# EAGLE design am-crystal-rx (EAGLE 7.6.0)
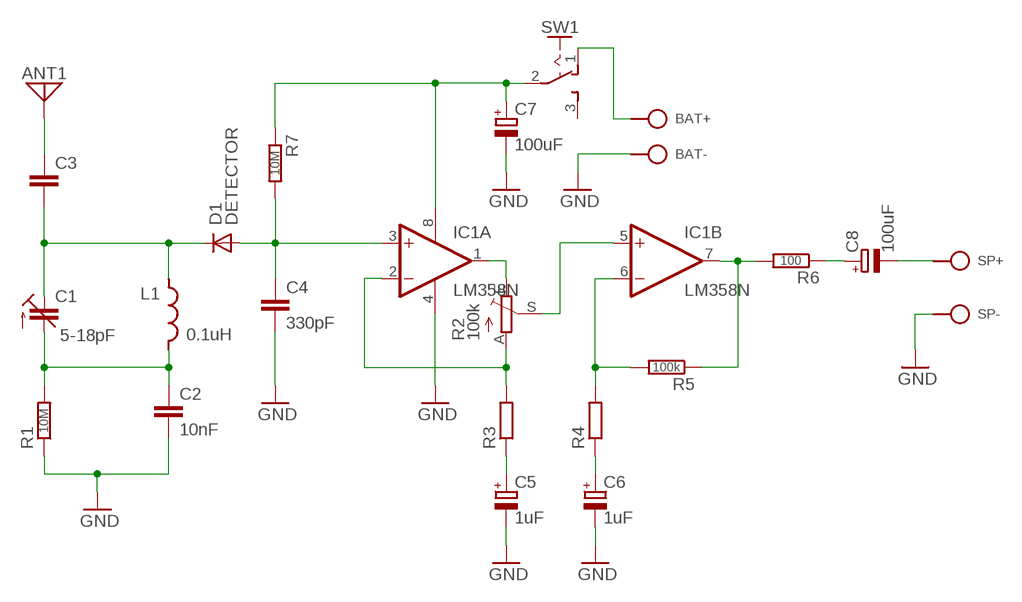
[diagram p0: schematic, sheet 1]

## Parts
ANT1  ANT  [SPAD]
BAT+  BAT+  SPAD  [SPAD]
BAT-  BAT-  SPAD  [SPAD]
C1  5-18pF  C-TR-PH201272222-808-2PIN  [TRIM-2222-808]
C2  10nF  C050-025X075  [C050-025X075]
C3  C025-015X024  [C025-015X024]
C4  330pF  C050-024X044  [C050-024X044]
C5  1uF  CPOLE2,5-3  [E2,5-3]
C6  1uF  CPOLE2,5-3  [E2,5-3]
C7  100uF  CPOLE2.5-5  [E2,5-5]
C8  100uF  CPOLE2.5-5  [E2,5-5]
D1  DETECTOR  1N414834-10  [DO34-10]
IC1  LM358N  [DIL08]
L1  0.1uH  L-SHORT04/10  [L-04/10]
R1  10M  R0202/7-V  [0202/7-V]
R2  100k  TRIM_EU-B64Y  [B64Y]
R3  R0202/7  [0202/7]
R4  R0202/7  [0202/7]
R5  100k  R0202/7  [0202/7]
R6  100  R0202/7  [0202/7]
R7  10M  R0202/7  [0202/7]
SP+  SPKR+  SPAD  [SPAD]
SP-  SPKR-  SPAD  [SPAD]
SW1  SL-SW-1P-2T-H  [SLSW-1P2T-H]

## Nets
GND: BAT-.1 C2.2 C4.2 C5.- C6.- C7.- IC1.4(P:V-) R1.1 SP-.1
N$1: C4.1 D1.A IC1.3(A:+IN) R7.2
N$2: C7.+ IC1.8(P:V+) R7.1 SW1.2(P)
N$3: C1.2(E) C2.1 L1.2 R1.2
N$4: IC1.2(A:-IN) R2.A R3.2
N$5: C1.1(A) C3.2 D1.C L1.1
N$6: ANT1.1 C3.1
N$7: IC1.1(A:OUT) R2.E
N$8: IC1.5(B:+IN) R2.S
N$9: IC1.7(B:OUT) R5.1 R6.2
N$10: IC1.6(B:-IN) R4.2 R5.2
N$11: C5.+ R3.1
N$12: C6.+ R4.1
N$13: C8.+ R6.1
N$14: C8.- SP+.1
N$15: BAT+.1 SW1.1(O)
Unconnected: SW1.3(S)

## Library data of the parts
ANT1 = pad:ANT
BAT+ BAT- SP+ SP- = pad:SPAD
C1 = cap-trim:C-TR-PH20127
C2-C4 = c:C: CAPACITOR, European symbol
C5-C8 = c:CPOL: POLARIZED CAPACITOR, European symbol
D1 = d:1N4148
IC1 = ic:LM358: OP AMP also LM158; LM258; LM2904 Source: http://cache.national.com/ds/LM/LM158.pdf
L1 = r:L-SHORT
R1 R3-R7 = r:R: RESISTOR, European symbol
R2 = pot:TRIM_EU-: POTENTIOMETER
SW1 = sw:SL-SW-1P-2T

## Board
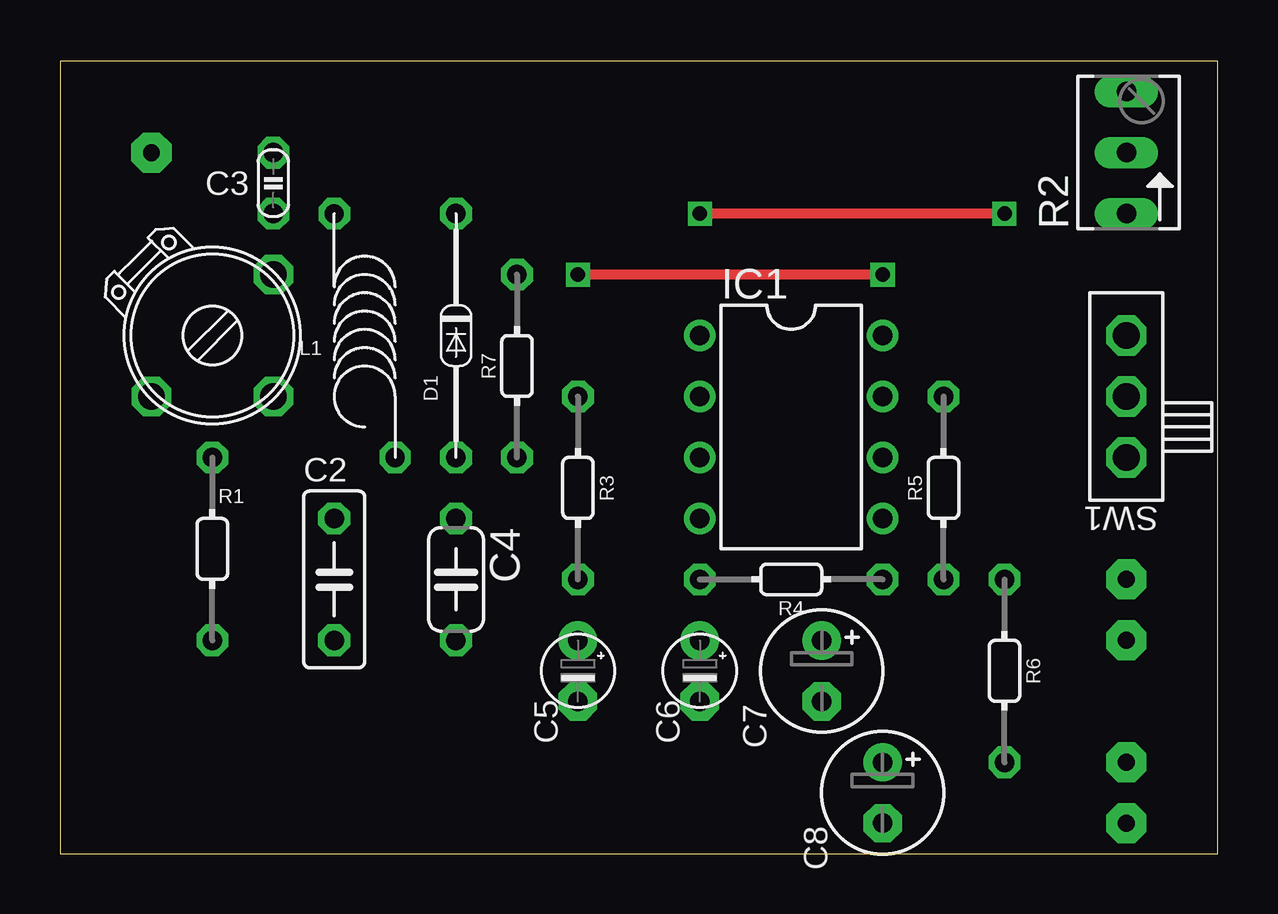
[diagram p1: board, top side]
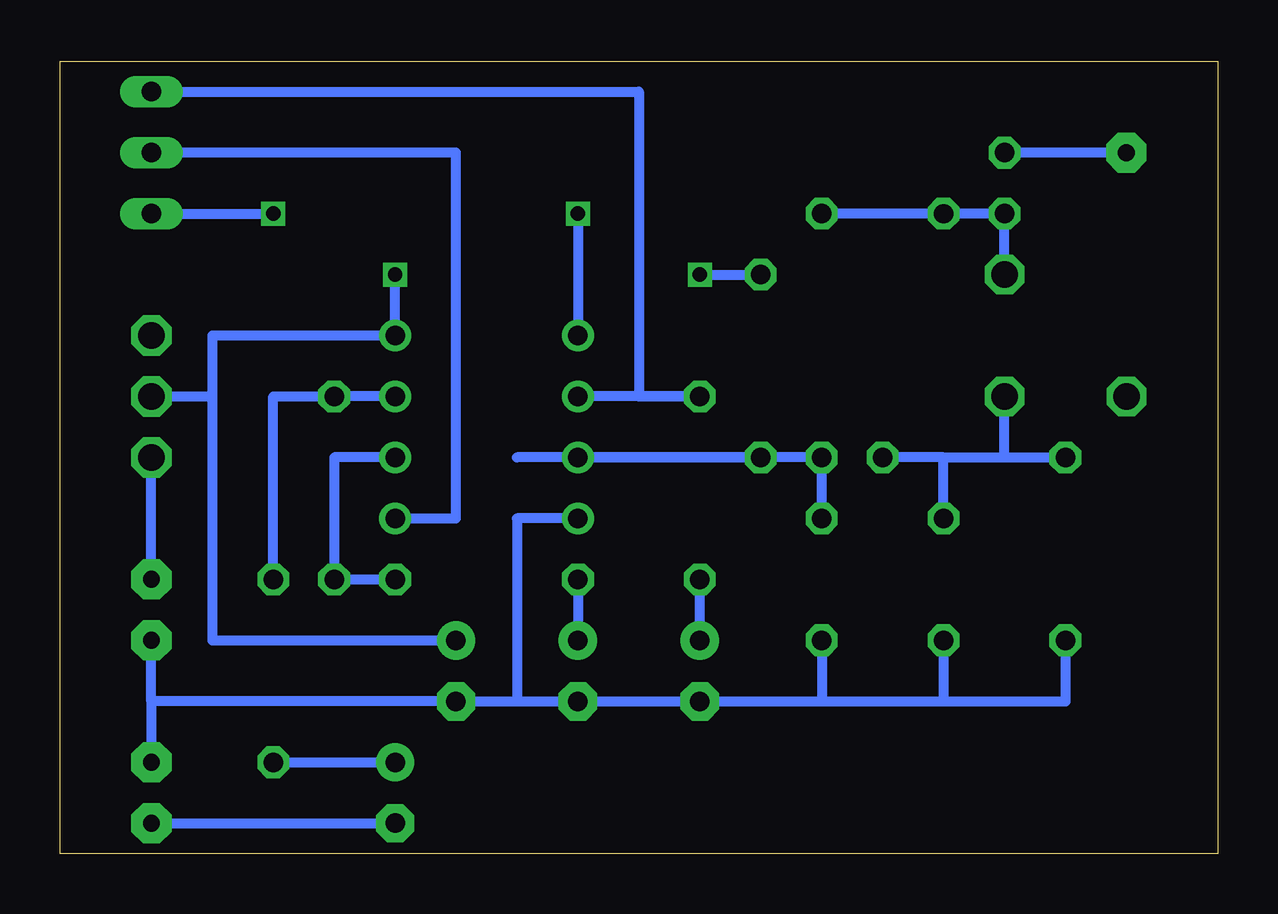
[diagram p2: board, bottom side, seen from below]

Size 48.26 x 33.02 mm. Coordinates in mm from the lower left corner, seen from the top.
Outline: 0,0 48.26,0 48.26,33.02 0,33.02 0,0
Copper layers (1*16): Top 0.035mm / dielectric 1.5mm / Bottom 0.035mm
Design rules "default": minimum track width 10mil, minimum drill 24mil, track to track 8mil, track to pad 8mil, pad to pad 8mil, via to via 8mil, smd to smd 8mil, copper to edge 40mil, drill to drill 8mil, minimum pad ring 10mil, minimum via ring 8mil, stop-mask expansion 4mil, vias tented up to drill 0mil, thermal gap 10mil

### Footprints (pad centres in the part's own frame; a part is rotated, then mirrored left to right if it is on the bottom)
SPAD = drill 0.7 pad 1.676 octagon: 1 0,0
TRIM-2222-808 = drill 1.1 octagon: 1 -2.54,2.54; 2 2.54,2.54; 3 2.54,-2.54
C050-025X075 = drill 0.813 octagon: 1 2.54,0; 2 -2.54,0
C025-015X024 = drill 0.813 octagon: 1 0,1.27; 2 0,-1.27
C050-024X044 = drill 0.813 octagon: 1 -2.54,0; 2 2.54,0
E2,5-3 = drill 0.813 pad 1.6: + 1.27,0 | drill 0.813 pad 1.6 octagon: - -1.27,0
E2,5-5 = drill 0.813 pad 1.6: + 1.27,0 | drill 0.813 pad 1.6 octagon: - -1.27,0
DO34-10 = drill 0.813 octagon: A 5.08,0; C -5.08,0
DIL08 = drill 0.813 pad 1.27: 1 -3.81,-3.81; 2 -1.27,-3.81; 3 1.27,-3.81; 4 3.81,-3.81; 5 3.81,3.81; 6 1.27,3.81; 7 -1.27,3.81; 8 -3.81,3.81
L-04/10 = drill 0.8 octagon: 1 -2.54,6.35; 2 0,-3.81
0202/7-V = drill 0.813 octagon: 1 0,-3.81; 2 0,3.81
B64Y = drill 0.813 long: A 2.54,0; E -2.54,0; S 0,0
0202/7 = drill 0.813 octagon: 1 -3.81,0; 2 3.81,0
SLSW-1P2T-H = drill 1.118 pad 1.524 octagon: 1 2.54,0; 2 0,0; 3 -2.54,0

### Placement (x,y rotation side)
ANT1  3.81,29.21 0 top
BAT+  44.45,11.43 0 top
BAT-  44.45,8.89 0 top
C1  6.35,21.59 270 top
C2  11.43,11.43 90 top
C3  8.89,27.94 0 top
C4  16.51,11.43 270 top
C5  21.59,7.62 90 top
C6  26.67,7.62 90 top
C7  31.75,7.62 90 top
C8  34.29,2.54 90 top
D1  16.51,21.59 270 top
IC1  30.48,17.78 270 top
L1  13.97,20.32 0 top
R1  6.35,12.7 0 top
R2  44.45,29.21 90 top
R3  21.59,15.24 90 top
R4  30.48,11.43 0 top
R5  36.83,15.24 270 top
R6  39.37,7.62 90 top
R7  19.05,20.32 270 top
SP+  44.45,1.27 0 top
SP-  44.45,3.81 0 top
SW1  44.45,19.05 270 top

### Tracks (layer width: path | path; a pad name or v marks a point on that pad's centre or on a via)
GND
  Bottom 0.406: IC1.4 29.21,13.97 29.21,6.35 | 29.21,6.35 C7.- 44.45,6.35 | 29.21,6.35 C6.- C5.- 16.51,6.35 | C4.2 16.51,6.35 | 16.51,6.35 11.43,6.35 | C2.2 11.43,6.35 | 11.43,6.35 6.35,6.35 R1.1 | 44.45,6.35 BAT-.1 | 44.45,6.35 SP-.1
N$1
  Bottom 0.406: IC1.3 29.21,16.51 | IC1.3 R7.2 | C4.1 D1.A IC1.3
N$2  (via drill 0.6)
  Top 0.406: v34.29,24.13 v21.59,24.13
  Bottom 0.406: SW1.2 41.91,19.05 | 41.91,19.05 41.91,8.89 C7.+ | 41.91,19.05 41.91,21.59 IC1.8 v34.29,24.13 | v21.59,24.13 R7.1
N$3
  Bottom 0.406: 11.43,16.51 L1.2 | C2.1 11.43,16.51 | 8.89,16.51 R1.2 | 11.43,16.51 8.89,16.51 | 8.89,16.51 C1.2
N$4
  Bottom 0.406: IC1.2 R3.2 24.13,19.05 24.13,31.75 R2.A
N$5
  Bottom 0.406: C1.1 C3.2 L1.1 D1.C
N$6
  Bottom 0.406: ANT1.1 C3.1
N$7  (via drill 0.6)
  Top 0.406: v39.37,26.67 v26.67,26.67
  Bottom 0.406: R2.E v39.37,26.67 | v26.67,26.67 IC1.1
N$8
  Bottom 0.406: IC1.5 31.75,13.97 31.75,29.21 R2.S
N$9
  Bottom 0.406: IC1.7 R5.1 39.37,19.05 R6.2
N$10
  Bottom 0.406: IC1.6 36.83,16.51 R5.2 R4.2
N$11
  Bottom 0.406: C5.+ R3.1
N$12
  Bottom 0.406: R4.1 C6.+
N$13
  Bottom 0.406: R6.1 C8.+
N$14
  Bottom 0.406: SP+.1 C8.-
N$15
  Bottom 0.406: BAT+.1 SW1.1